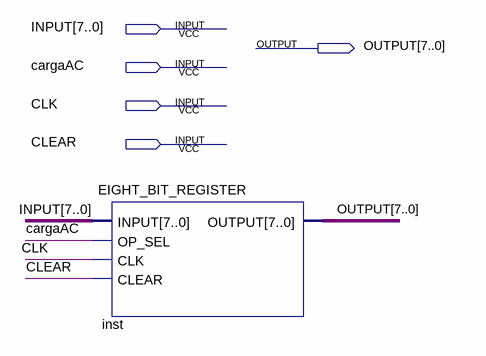
[diagram p0: schematic sheet]
// Quartus schematic AC.bdf as structural Verilog: 1 symbols, 5 pins
module AC (
  input  [7:0] INPUT,
  input  cargaAC,
  input  CLK,
  input  CLEAR,
  output [7:0] OUTPUT
);

  EIGHT_BIT_REGISTER inst (.INPUT(INPUT), .OP_SEL(cargaAC), .CLK(CLK), .CLEAR(CLEAR), .OUTPUT(OUTPUT));
endmodule
